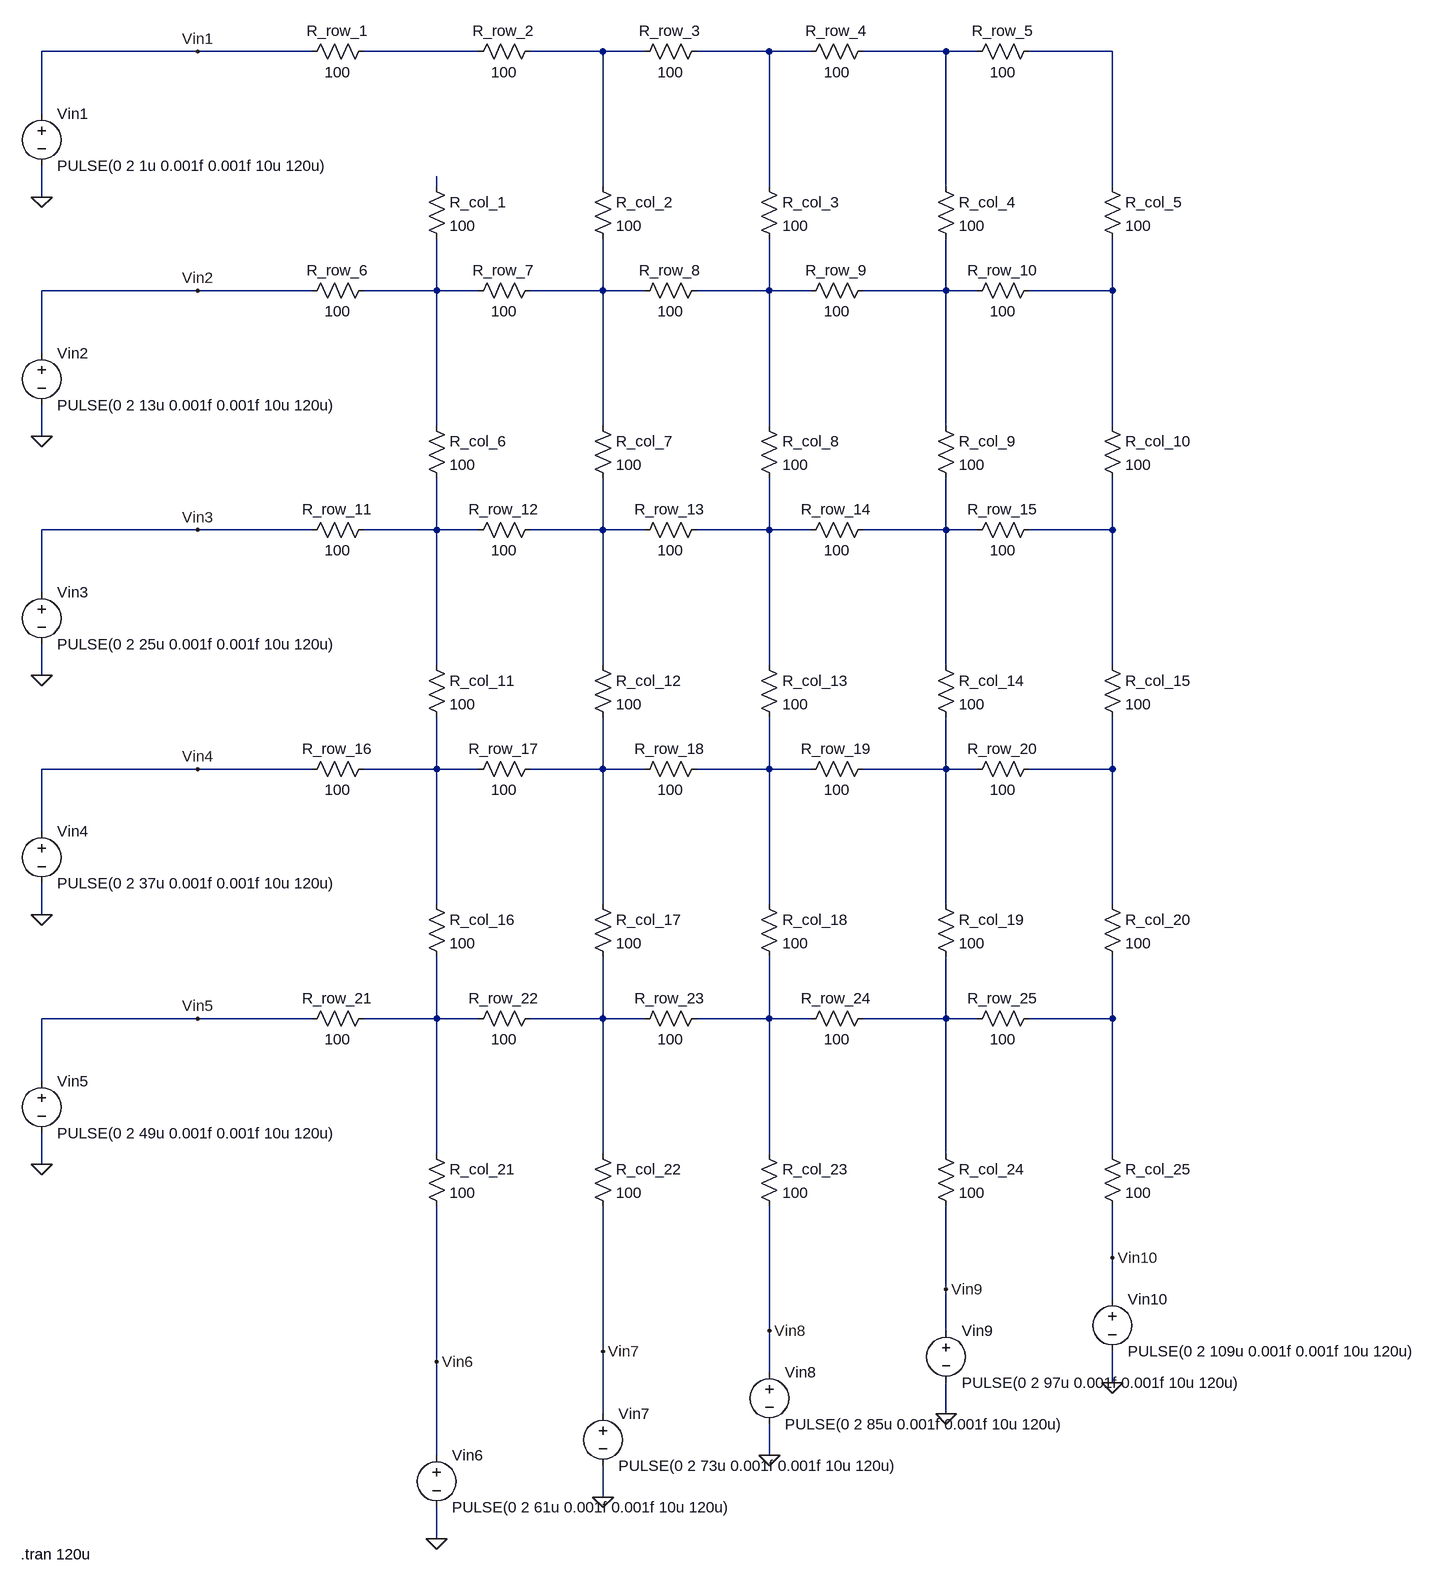
[diagram p0: schematic Memristor_new_1_1_open_5_by_5.asc]
Memristor_new_1_1_open_5_by_5.asc, the LTspice schematic file:
Version 4
SHEET 1 2248 2344
WIRE 48 16 -192 16
WIRE 224 16 48 16
WIRE 480 16 304 16
WIRE 672 16 560 16
WIRE 736 16 672 16
WIRE 928 16 816 16
WIRE 992 16 928 16
WIRE 1200 16 1072 16
WIRE 1248 16 1200 16
WIRE 1456 16 1328 16
WIRE -192 112 -192 16
WIRE 416 224 416 208
WIRE 672 224 672 16
WIRE 928 224 928 16
WIRE 1200 224 1200 16
WIRE 1456 224 1456 16
WIRE -192 240 -192 192
WIRE 48 384 -192 384
WIRE 224 384 48 384
WIRE 416 384 416 304
WIRE 416 384 304 384
WIRE 480 384 416 384
WIRE 672 384 672 304
WIRE 672 384 560 384
WIRE 736 384 672 384
WIRE 928 384 928 304
WIRE 928 384 816 384
WIRE 992 384 928 384
WIRE 1200 384 1200 304
WIRE 1200 384 1072 384
WIRE 1248 384 1200 384
WIRE 1456 384 1456 304
WIRE 1456 384 1328 384
WIRE -192 480 -192 384
WIRE 416 592 416 384
WIRE 672 592 672 384
WIRE 928 592 928 384
WIRE 1200 592 1200 384
WIRE 1456 592 1456 384
WIRE -192 608 -192 560
WIRE 48 752 -192 752
WIRE 224 752 48 752
WIRE 416 752 416 672
WIRE 416 752 304 752
WIRE 480 752 416 752
WIRE 672 752 672 672
WIRE 672 752 560 752
WIRE 736 752 672 752
WIRE 928 752 928 672
WIRE 928 752 816 752
WIRE 992 752 928 752
WIRE 1200 752 1200 672
WIRE 1200 752 1072 752
WIRE 1248 752 1200 752
WIRE 1456 752 1456 672
WIRE 1456 752 1328 752
WIRE -192 848 -192 752
WIRE 416 960 416 752
WIRE 672 960 672 752
WIRE 928 960 928 752
WIRE 1200 960 1200 752
WIRE 1456 960 1456 752
WIRE -192 976 -192 928
WIRE 48 1120 -192 1120
WIRE 224 1120 48 1120
WIRE 416 1120 416 1040
WIRE 416 1120 304 1120
WIRE 480 1120 416 1120
WIRE 672 1120 672 1040
WIRE 672 1120 560 1120
WIRE 736 1120 672 1120
WIRE 928 1120 928 1040
WIRE 928 1120 816 1120
WIRE 992 1120 928 1120
WIRE 1200 1120 1200 1040
WIRE 1200 1120 1072 1120
WIRE 1248 1120 1200 1120
WIRE 1456 1120 1456 1040
WIRE 1456 1120 1328 1120
WIRE -192 1216 -192 1120
WIRE 416 1328 416 1120
WIRE 672 1328 672 1120
WIRE 928 1328 928 1120
WIRE 1200 1328 1200 1120
WIRE 1456 1328 1456 1120
WIRE -192 1344 -192 1296
WIRE 48 1504 -192 1504
WIRE 224 1504 48 1504
WIRE 416 1504 416 1408
WIRE 416 1504 304 1504
WIRE 480 1504 416 1504
WIRE 672 1504 672 1408
WIRE 672 1504 560 1504
WIRE 736 1504 672 1504
WIRE 928 1504 928 1408
WIRE 928 1504 816 1504
WIRE 992 1504 928 1504
WIRE 1200 1504 1200 1408
WIRE 1200 1504 1072 1504
WIRE 1248 1504 1200 1504
WIRE 1456 1504 1456 1408
WIRE 1456 1504 1328 1504
WIRE -192 1600 -192 1504
WIRE 416 1712 416 1504
WIRE 672 1712 672 1504
WIRE 928 1712 928 1504
WIRE 1200 1712 1200 1504
WIRE 1456 1712 1456 1504
WIRE -192 1728 -192 1680
WIRE 1456 1872 1456 1792
WIRE 1200 1920 1200 1792
WIRE 1456 1936 1456 1872
WIRE 928 1984 928 1792
WIRE 1200 1984 1200 1920
WIRE 672 2016 672 1792
WIRE 416 2032 416 1792
WIRE 928 2048 928 1984
WIRE 1456 2064 1456 2016
WIRE 672 2112 672 2016
WIRE 1200 2112 1200 2064
WIRE 416 2176 416 2032
WIRE 928 2176 928 2128
WIRE 672 2240 672 2192
WIRE 416 2304 416 2256
FLAG -192 240 0
FLAG -192 608 0
FLAG -192 976 0
FLAG -192 1344 0
FLAG -192 1728 0
FLAG 416 2304 0
FLAG 672 2240 0
FLAG 928 2176 0
FLAG 1200 2112 0
FLAG 1456 2064 0
FLAG 48 16 Vin1
FLAG 48 384 Vin2
FLAG 48 752 Vin3
FLAG 48 1120 Vin4
FLAG 48 1504 Vin5
FLAG 416 2032 Vin6
FLAG 672 2016 Vin7
FLAG 928 1984 Vin8
FLAG 1200 1920 Vin9
FLAG 1456 1872 Vin10
SYMBOL voltage -192 96 R0
WINDOW 123 0 0 Left 0
WINDOW 39 0 0 Left 0
SYMATTR InstName Vin1
SYMATTR Value PULSE(0 2 1u 0.001f 0.001f 10u 120u)
SYMBOL res 320 0 R90
WINDOW 0 0 56 VBottom 2
WINDOW 3 32 56 VTop 2
SYMATTR InstName R_row_1
SYMATTR Value 100
SYMBOL res 576 0 R90
WINDOW 0 0 56 VBottom 2
WINDOW 3 32 56 VTop 2
SYMATTR InstName R_row_2
SYMATTR Value 100
SYMBOL res 832 0 R90
WINDOW 0 0 56 VBottom 2
WINDOW 3 32 56 VTop 2
SYMATTR InstName R_row_3
SYMATTR Value 100
SYMBOL res 1088 0 R90
WINDOW 0 0 56 VBottom 2
WINDOW 3 32 56 VTop 2
SYMATTR InstName R_row_4
SYMATTR Value 100
SYMBOL res 1344 0 R90
WINDOW 0 0 56 VBottom 2
WINDOW 3 32 56 VTop 2
SYMATTR InstName R_row_5
SYMATTR Value 100
SYMBOL res 400 208 R0
SYMATTR InstName R_col_1
SYMATTR Value 100
SYMBOL res 656 208 R0
SYMATTR InstName R_col_2
SYMATTR Value 100
SYMBOL res 912 208 R0
SYMATTR InstName R_col_3
SYMATTR Value 100
SYMBOL res 1184 208 R0
SYMATTR InstName R_col_4
SYMATTR Value 100
SYMBOL res 1440 208 R0
SYMATTR InstName R_col_5
SYMATTR Value 100
SYMBOL voltage -192 464 R0
WINDOW 123 0 0 Left 0
WINDOW 39 0 0 Left 0
SYMATTR InstName Vin2
SYMATTR Value PULSE(0 2 13u 0.001f 0.001f 10u 120u)
SYMBOL res 320 368 R90
WINDOW 0 0 56 VBottom 2
WINDOW 3 32 56 VTop 2
SYMATTR InstName R_row_6
SYMATTR Value 100
SYMBOL res 576 368 R90
WINDOW 0 0 56 VBottom 2
WINDOW 3 32 56 VTop 2
SYMATTR InstName R_row_7
SYMATTR Value 100
SYMBOL res 832 368 R90
WINDOW 0 0 56 VBottom 2
WINDOW 3 32 56 VTop 2
SYMATTR InstName R_row_8
SYMATTR Value 100
SYMBOL res 1088 368 R90
WINDOW 0 0 56 VBottom 2
WINDOW 3 32 56 VTop 2
SYMATTR InstName R_row_9
SYMATTR Value 100
SYMBOL res 1344 368 R90
WINDOW 0 0 56 VBottom 2
WINDOW 3 32 56 VTop 2
SYMATTR InstName R_row_10
SYMATTR Value 100
SYMBOL res 400 576 R0
SYMATTR InstName R_col_6
SYMATTR Value 100
SYMBOL res 656 576 R0
SYMATTR InstName R_col_7
SYMATTR Value 100
SYMBOL res 912 576 R0
SYMATTR InstName R_col_8
SYMATTR Value 100
SYMBOL res 1184 576 R0
SYMATTR InstName R_col_9
SYMATTR Value 100
SYMBOL res 1440 576 R0
SYMATTR InstName R_col_10
SYMATTR Value 100
SYMBOL voltage -192 832 R0
WINDOW 123 0 0 Left 0
WINDOW 39 0 0 Left 0
SYMATTR InstName Vin3
SYMATTR Value PULSE(0 2 25u 0.001f 0.001f 10u 120u)
SYMBOL res 320 736 R90
WINDOW 0 0 56 VBottom 2
WINDOW 3 32 56 VTop 2
SYMATTR InstName R_row_11
SYMATTR Value 100
SYMBOL res 576 736 R90
WINDOW 0 0 56 VBottom 2
WINDOW 3 32 56 VTop 2
SYMATTR InstName R_row_12
SYMATTR Value 100
SYMBOL res 832 736 R90
WINDOW 0 0 56 VBottom 2
WINDOW 3 32 56 VTop 2
SYMATTR InstName R_row_13
SYMATTR Value 100
SYMBOL res 1088 736 R90
WINDOW 0 0 56 VBottom 2
WINDOW 3 32 56 VTop 2
SYMATTR InstName R_row_14
SYMATTR Value 100
SYMBOL res 1344 736 R90
WINDOW 0 0 56 VBottom 2
WINDOW 3 32 56 VTop 2
SYMATTR InstName R_row_15
SYMATTR Value 100
SYMBOL res 400 944 R0
SYMATTR InstName R_col_11
SYMATTR Value 100
SYMBOL res 656 944 R0
SYMATTR InstName R_col_12
SYMATTR Value 100
SYMBOL res 912 944 R0
SYMATTR InstName R_col_13
SYMATTR Value 100
SYMBOL res 1184 944 R0
SYMATTR InstName R_col_14
SYMATTR Value 100
SYMBOL res 1440 944 R0
SYMATTR InstName R_col_15
SYMATTR Value 100
SYMBOL voltage -192 1200 R0
WINDOW 123 0 0 Left 0
WINDOW 39 0 0 Left 0
SYMATTR InstName Vin4
SYMATTR Value PULSE(0 2 37u 0.001f 0.001f 10u 120u)
SYMBOL res 320 1104 R90
WINDOW 0 0 56 VBottom 2
WINDOW 3 32 56 VTop 2
SYMATTR InstName R_row_16
SYMATTR Value 100
SYMBOL res 576 1104 R90
WINDOW 0 0 56 VBottom 2
WINDOW 3 32 56 VTop 2
SYMATTR InstName R_row_17
SYMATTR Value 100
SYMBOL res 832 1104 R90
WINDOW 0 0 56 VBottom 2
WINDOW 3 32 56 VTop 2
SYMATTR InstName R_row_18
SYMATTR Value 100
SYMBOL res 1088 1104 R90
WINDOW 0 0 56 VBottom 2
WINDOW 3 32 56 VTop 2
SYMATTR InstName R_row_19
SYMATTR Value 100
SYMBOL res 1344 1104 R90
WINDOW 0 0 56 VBottom 2
WINDOW 3 32 56 VTop 2
SYMATTR InstName R_row_20
SYMATTR Value 100
SYMBOL res 400 1312 R0
SYMATTR InstName R_col_16
SYMATTR Value 100
SYMBOL res 656 1312 R0
SYMATTR InstName R_col_17
SYMATTR Value 100
SYMBOL res 912 1312 R0
SYMATTR InstName R_col_18
SYMATTR Value 100
SYMBOL res 1184 1312 R0
SYMATTR InstName R_col_19
SYMATTR Value 100
SYMBOL res 1440 1312 R0
SYMATTR InstName R_col_20
SYMATTR Value 100
SYMBOL voltage -192 1584 R0
WINDOW 123 0 0 Left 0
WINDOW 39 0 0 Left 0
SYMATTR InstName Vin5
SYMATTR Value PULSE(0 2 49u 0.001f 0.001f 10u 120u)
SYMBOL res 320 1488 R90
WINDOW 0 0 56 VBottom 2
WINDOW 3 32 56 VTop 2
SYMATTR InstName R_row_21
SYMATTR Value 100
SYMBOL res 576 1488 R90
WINDOW 0 0 56 VBottom 2
WINDOW 3 32 56 VTop 2
SYMATTR InstName R_row_22
SYMATTR Value 100
SYMBOL res 832 1488 R90
WINDOW 0 0 56 VBottom 2
WINDOW 3 32 56 VTop 2
SYMATTR InstName R_row_23
SYMATTR Value 100
SYMBOL res 1088 1488 R90
WINDOW 0 0 56 VBottom 2
WINDOW 3 32 56 VTop 2
SYMATTR InstName R_row_24
SYMATTR Value 100
SYMBOL res 1344 1488 R90
WINDOW 0 0 56 VBottom 2
WINDOW 3 32 56 VTop 2
SYMATTR InstName R_row_25
SYMATTR Value 100
SYMBOL res 400 1696 R0
SYMATTR InstName R_col_21
SYMATTR Value 100
SYMBOL res 656 1696 R0
SYMATTR InstName R_col_22
SYMATTR Value 100
SYMBOL res 912 1696 R0
SYMATTR InstName R_col_23
SYMATTR Value 100
SYMBOL res 1184 1696 R0
SYMATTR InstName R_col_24
SYMATTR Value 100
SYMBOL res 1440 1696 R0
SYMATTR InstName R_col_25
SYMATTR Value 100
SYMBOL voltage 416 2160 R0
WINDOW 123 0 0 Left 0
WINDOW 39 0 0 Left 0
SYMATTR InstName Vin6
SYMATTR Value PULSE(0 2 61u 0.001f 0.001f 10u 120u)
SYMBOL voltage 672 2096 R0
WINDOW 123 0 0 Left 0
WINDOW 39 0 0 Left 0
SYMATTR InstName Vin7
SYMATTR Value PULSE(0 2 73u 0.001f 0.001f 10u 120u)
SYMBOL voltage 928 2032 R0
WINDOW 123 0 0 Left 0
WINDOW 39 0 0 Left 0
SYMATTR InstName Vin8
SYMATTR Value PULSE(0 2 85u 0.001f 0.001f 10u 120u)
SYMBOL voltage 1200 1968 R0
WINDOW 123 0 0 Left 0
WINDOW 39 0 0 Left 0
SYMATTR InstName Vin9
SYMATTR Value PULSE(0 2 97u 0.001f 0.001f 10u 120u)
SYMBOL voltage 1456 1920 R0
WINDOW 123 0 0 Left 0
WINDOW 39 0 0 Left 0
SYMATTR InstName Vin10
SYMATTR Value PULSE(0 2 109u 0.001f 0.001f 10u 120u)
TEXT -224 2328 Left 2 !.tran 120u

The netlist it stands for:
* Memristor_new_1_1_open_5_by_5.asc
Vin1 Vin1 0 PULSE(0 2 1u 0.001f 0.001f 10u 120u)
R_row_1 N001 Vin1 100
R_row_2 N002 N001 100
R_row_3 N003 N002 100
R_row_4 N004 N003 100
R_row_5 N005 N004 100
R_col_1 N006 N007 100
R_col_2 N002 N008 100
R_col_3 N003 N009 100
R_col_4 N004 N010 100
R_col_5 N005 N011 100
Vin2 Vin2 0 PULSE(0 2 13u 0.001f 0.001f 10u 120u)
R_row_6 N007 Vin2 100
R_row_7 N008 N007 100
R_row_8 N009 N008 100
R_row_9 N010 N009 100
R_row_10 N011 N010 100
R_col_6 N007 N012 100
R_col_7 N008 N013 100
R_col_8 N009 N014 100
R_col_9 N010 N015 100
R_col_10 N011 N016 100
Vin3 Vin3 0 PULSE(0 2 25u 0.001f 0.001f 10u 120u)
R_row_11 N012 Vin3 100
R_row_12 N013 N012 100
R_row_13 N014 N013 100
R_row_14 N015 N014 100
R_row_15 N016 N015 100
R_col_11 N012 N017 100
R_col_12 N013 N018 100
R_col_13 N014 N019 100
R_col_14 N015 N020 100
R_col_15 N016 N021 100
Vin4 Vin4 0 PULSE(0 2 37u 0.001f 0.001f 10u 120u)
R_row_16 N017 Vin4 100
R_row_17 N018 N017 100
R_row_18 N019 N018 100
R_row_19 N020 N019 100
R_row_20 N021 N020 100
R_col_16 N017 N022 100
R_col_17 N018 N023 100
R_col_18 N019 N024 100
R_col_19 N020 N025 100
R_col_20 N021 N026 100
Vin5 Vin5 0 PULSE(0 2 49u 0.001f 0.001f 10u 120u)
R_row_21 N022 Vin5 100
R_row_22 N023 N022 100
R_row_23 N024 N023 100
R_row_24 N025 N024 100
R_row_25 N026 N025 100
R_col_21 N022 Vin6 100
R_col_22 N023 Vin7 100
R_col_23 N024 Vin8 100
R_col_24 N025 Vin9 100
R_col_25 N026 Vin10 100
Vin6 Vin6 0 PULSE(0 2 61u 0.001f 0.001f 10u 120u)
Vin7 Vin7 0 PULSE(0 2 73u 0.001f 0.001f 10u 120u)
Vin8 Vin8 0 PULSE(0 2 85u 0.001f 0.001f 10u 120u)
Vin9 Vin9 0 PULSE(0 2 97u 0.001f 0.001f 10u 120u)
Vin10 Vin10 0 PULSE(0 2 109u 0.001f 0.001f 10u 120u)
.tran 120u
.backanno
.end